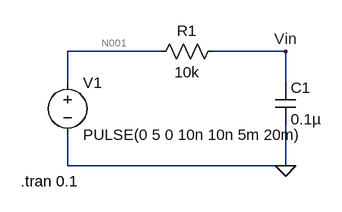
[diagram p0: schematic RC_circuit.asc]
RC_circuit.asc, the LTspice schematic file:
Version 4
SHEET 1 880 680
WIRE 208 96 64 96
WIRE 400 96 288 96
WIRE 64 144 64 96
WIRE 400 144 400 96
WIRE 64 272 64 224
WIRE 400 272 400 208
WIRE 400 272 64 272
FLAG 400 272 0
FLAG 400 96 Vin
SYMBOL voltage 64 128 R0
WINDOW 123 0 0 Left 0
WINDOW 39 0 0 Left 0
SYMATTR InstName V1
SYMATTR Value PULSE(0 5 0 10n 10n 5m 20m)
SYMBOL res 304 80 R90
WINDOW 0 0 56 VBottom 2
WINDOW 3 32 56 VTop 2
SYMATTR InstName R1
SYMATTR Value 10k
SYMBOL cap 384 144 R0
SYMATTR InstName C1
SYMATTR Value 0.1µ
TEXT -8 296 Left 2 !.tran 0.1

The netlist it stands for:
* RC_circuit.asc
V1 N001 0 PULSE(0 5 0 10n 10n 5m 20m)
R1 Vin N001 10k
C1 Vin 0 0.1µ
.tran 0.1
.backanno
.end

* Results of the author's LTspice run, read from the files saved beside the schematic
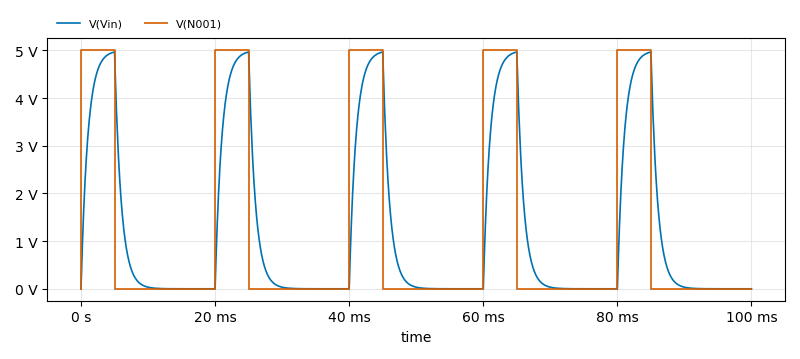
[diagram p1: Transient Analysis of RC_circuit.asc, plotted from the saved traces]
* Transient Analysis, 1 run:
*   V(Vin): min 0 V, max 4.966 V, average 1.251 V, rms 2.241 V, last 1.502 µV
*   V(N001): min 0 V, max 5 V, average 1.25 V, rms 2.5 V, last 0 V